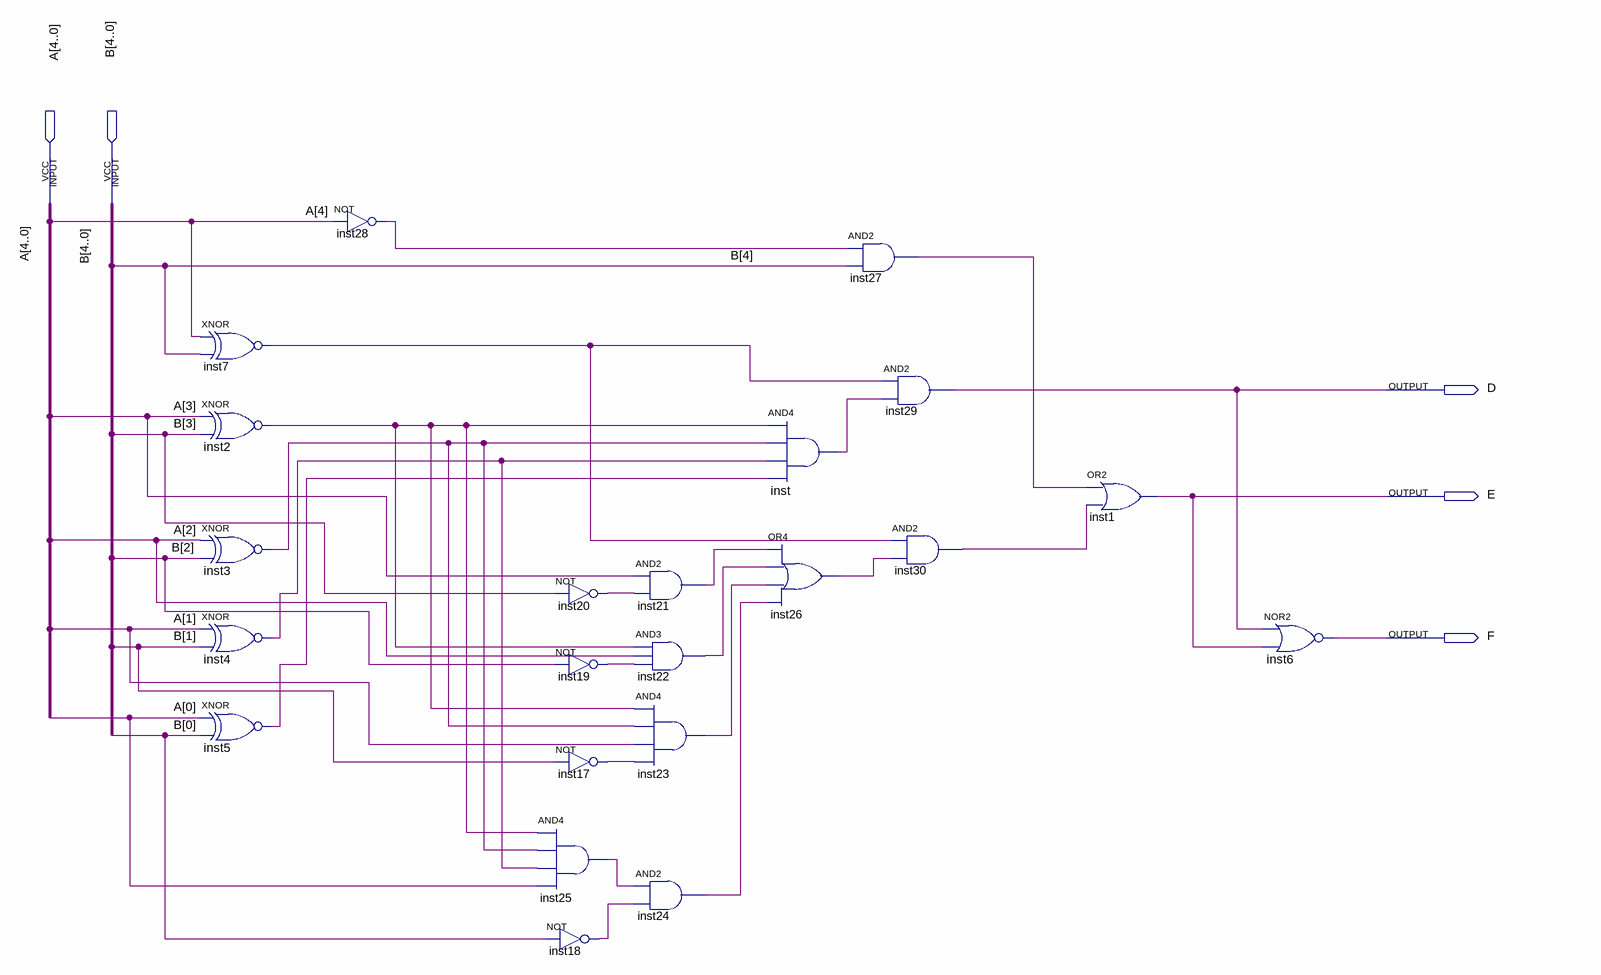
[diagram p0: schematic sheet]
// Quartus schematic comparador_magnitude.bdf as structural Verilog: 22 symbols, 5 pins
module comparador_magnitude (
  input  [4:0] A,
  input  [4:0] B,
  output D,
  output E,
  output F
);

  wire inst2_out, inst3_out, inst4_out, inst5_out, inst7_out, inst17_out, inst18_out, inst19_out, inst20_out,
       inst21_out, inst22_out, inst23_out, inst24_out, inst25_out, inst26_out, inst27_out, inst28_out,
       inst30_out, inst_out;

  xnor inst7 (inst7_out, A[4], B[4]);
  xnor inst2 (inst2_out, A[3], B[3]);
  xnor inst3 (inst3_out, A[2], B[2]);
  xnor inst4 (inst4_out, A[1], B[1]);
  xnor inst5 (inst5_out, A[0], B[0]);
  not inst28 (inst28_out, A[4]);
  not inst20 (inst20_out, B[3]);
  not inst19 (inst19_out, B[2]);
  not inst17 (inst17_out, B[1]);
  and inst25 (inst25_out, inst2_out, inst3_out, inst4_out, A[0]);
  not inst18 (inst18_out, B[0]);
  and inst21 (inst21_out, A[3], inst20_out);
  and inst22 (inst22_out, inst2_out, A[2], inst19_out);
  and inst23 (inst23_out, inst2_out, inst3_out, A[1], inst17_out);
  and inst24 (inst24_out, inst25_out, inst18_out);
  and inst (inst_out, inst2_out, inst3_out, inst4_out, inst5_out);
  or inst26 (inst26_out, inst21_out, inst22_out, inst23_out, inst24_out);
  and inst27 (inst27_out, inst28_out, B[4]);
  and inst29 (D, inst7_out, inst_out);
  and inst30 (inst30_out, inst7_out, inst26_out);
  or inst1 (E, inst27_out, inst30_out);
  nor inst6 (F, D, E);
endmodule
